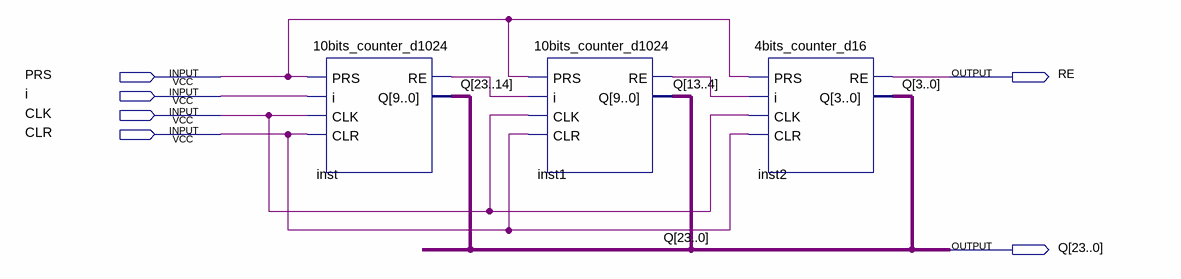
[diagram p0: schematic sheet]
// Quartus schematic 24bits_counter_d16777216.bdf as structural Verilog: 3 symbols, 6 pins
module \24bits_counter_d16777216  (
  input  PRS,
  input  i,
  input  CLK,
  input  CLR,
  output RE,
  output [23:0] Q
);

  wire inst1_re, inst_re;

  \10bits_counter_d1024  inst (.PRS(PRS), .i(i), .CLK(CLK), .CLR(CLR), .RE(inst_re), .Q(Q[23:14]));
  \10bits_counter_d1024  inst1 (.PRS(PRS), .i(inst_re), .CLK(CLK), .CLR(CLR), .RE(inst1_re), .Q(Q[13:4]));
  \4bits_counter_d16  inst2 (.PRS(PRS), .i(inst1_re), .CLK(CLK), .CLR(CLR), .RE(RE), .Q(Q[3:0]));
endmodule
